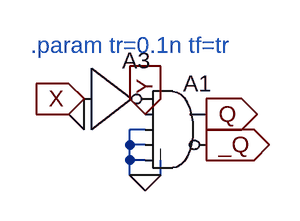
[diagram p0: schematic lt.asc]
lt.asc, the LTspice schematic file:
Version 4
SHEET 1 880 680
WIRE 128 128 112 128
WIRE 112 144 112 128
WIRE 128 144 112 144
WIRE 112 160 112 144
WIRE 128 160 112 160
WIRE 112 176 112 160
WIRE 128 176 112 176
WIRE 144 176 144 160
WIRE 144 176 128 176
FLAG 128 176 0
FLAG 64 112 0
FLAG 192 112 Q
IOPIN 192 112 Out
FLAG 192 144 _Q
IOPIN 192 144 Out
FLAG 64 96 X
IOPIN 64 96 In
FLAG 128 112 Y
IOPIN 128 112 In
SYMBOL Digital\\and 160 64 R0
SYMATTR InstName A1
SYMBOL Digital\\inv 64 32 R0
SYMATTR InstName A3
TEXT 8 40 Left 2 ;.param tr=0.1n tf=tr

The netlist it stands for:
* lt.asc
A1 P001 Y 0 0 0 _Q Q 0 AND
A3 X 0 0 0 0 P001 0 0 BUF
* .param tr=0.1n tf=tr
.backanno
.end